# EAGLE design 1 (EAGLE 7.5.0)
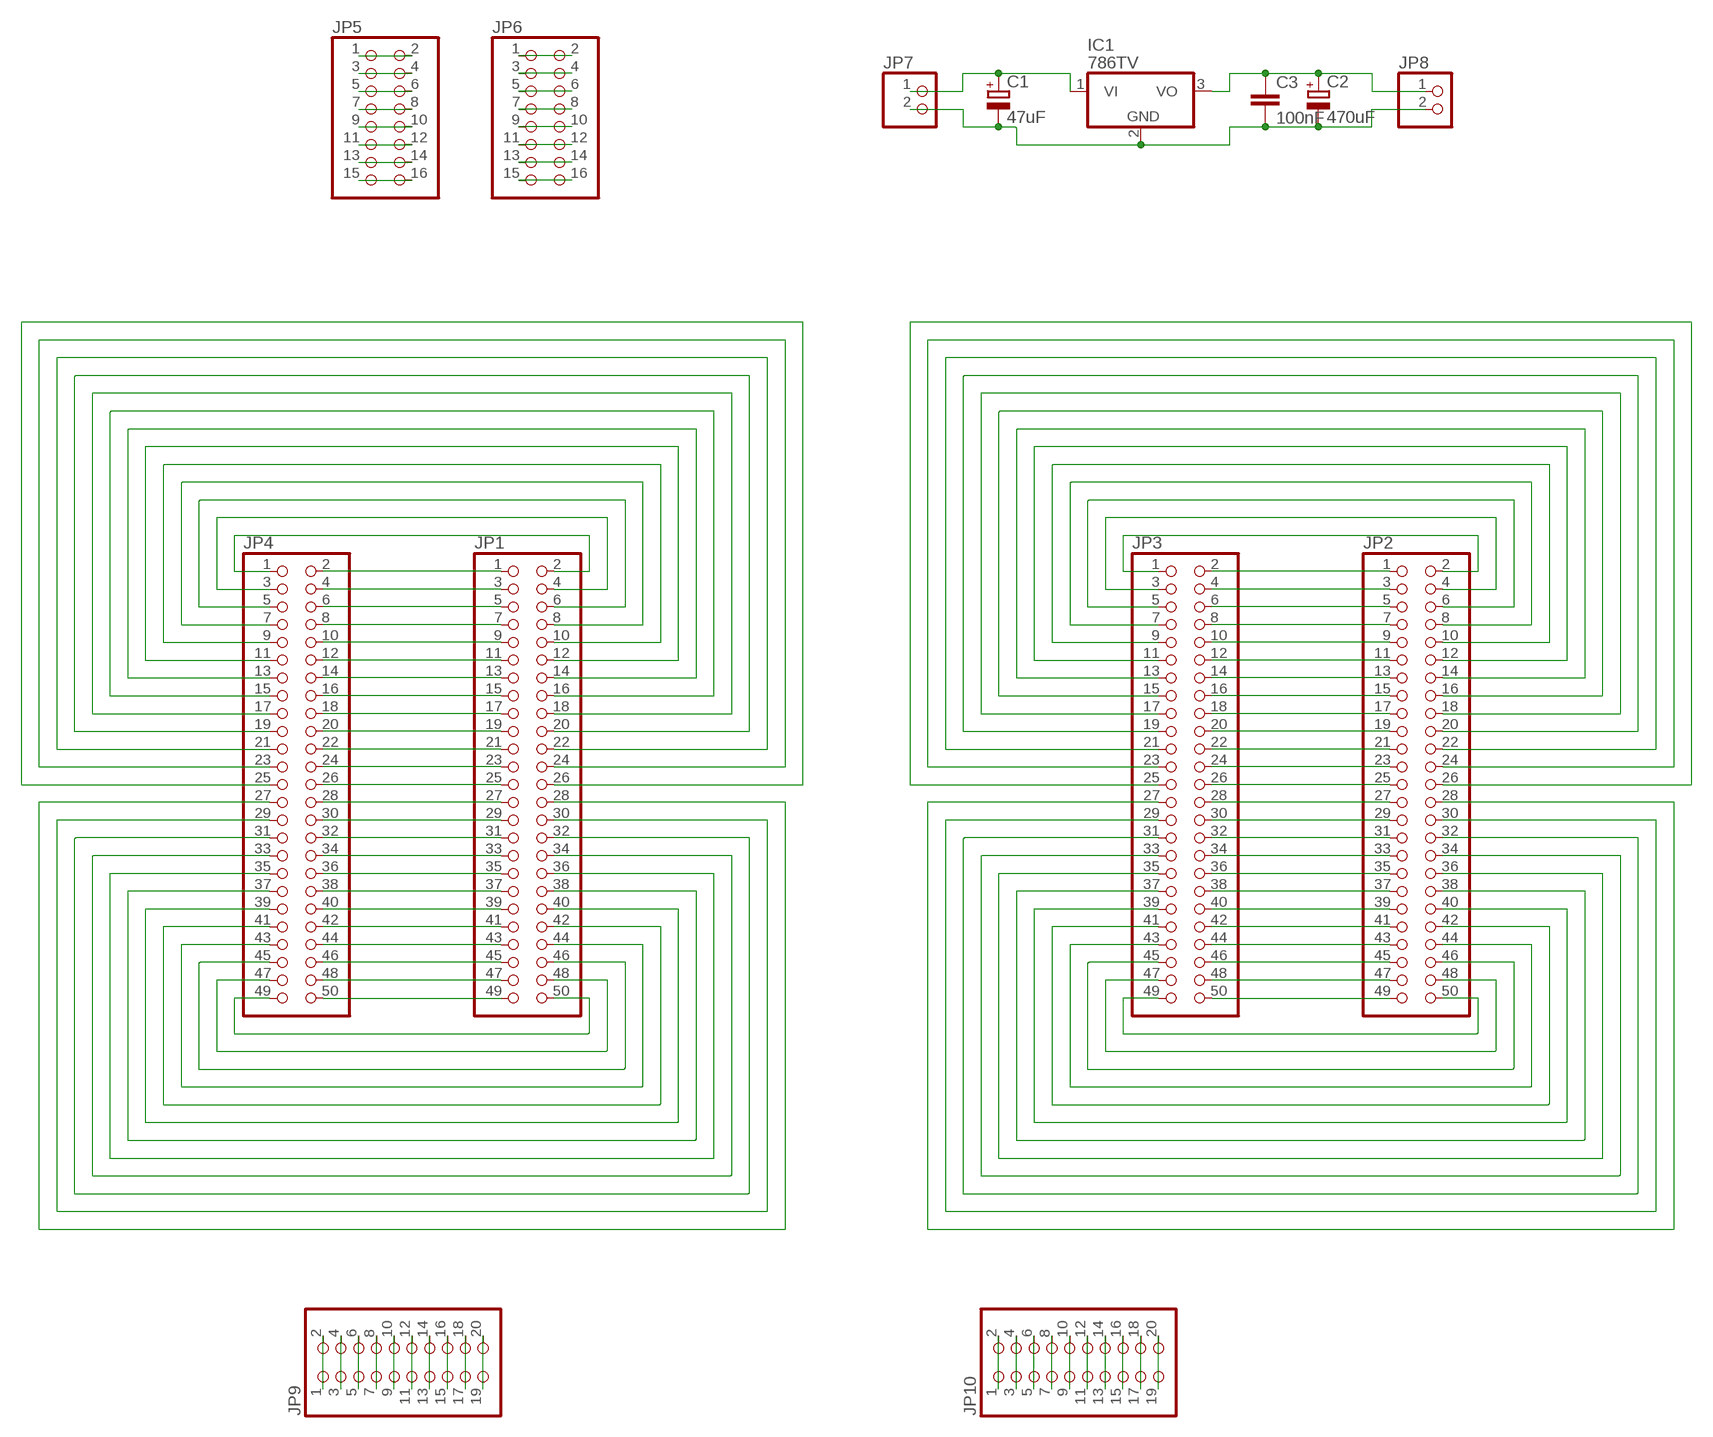
[diagram p0: schematic, sheet 1]

## Parts
C1  47uF  CPOL-EU153CLV-0405  [153CLV-0405]
C2  470uF  CPOL-EU153CLV-0405  [153CLV-0405]
C3  100nF  C-EU025-024X044  [C025-024X044]
IC1  786TV  [TO220V]
JP1  PINHD-2X25  [2X25]
JP2  PINHD-2X25  [2X25]
JP3  PINHD-2X25  [2X25]
JP4  PINHD-2X25  [2X25]
JP5  PINHD-2X8  [2X08]
JP6  PINHD-2X8  [2X08]
JP7  PINHD-1X2  [1X02]
JP8  PINHD-1X2  [1X02]
JP9  PINHD-2X10  [2X10]
JP10  PINHD-2X10  [2X10]

## Nets
N$1: JP5.1 JP5.2
N$2: JP5.3 JP5.4
N$3: JP5.5 JP5.6
N$4: JP5.7 JP5.8
N$5: JP5.9 JP5.10
N$6: JP5.11 JP5.12
N$7: JP5.13 JP5.14
N$8: JP5.15 JP5.16
N$9: JP6.1 JP6.2
N$10: JP6.3 JP6.4
N$11: JP6.5 JP6.6
N$12: JP6.7 JP6.8
N$13: JP6.9 JP6.10
N$14: JP6.11 JP6.12
N$15: JP6.13 JP6.14
N$16: JP6.15 JP6.16
N$17: C1.+ IC1.1(VI) JP7.1
N$18: C2.+ C3.1 IC1.3(VO) JP8.1
N$19: C1.- C2.- C3.2 IC1.2(GND) JP7.2 JP8.2
N$20: JP1.2 JP4.1
N$21: JP1.1 JP4.2
N$22: JP1.3 JP4.4
N$23: JP1.5 JP4.6
N$24: JP1.7 JP4.8
N$25: JP1.9 JP4.10
N$26: JP1.11 JP4.12
N$27: JP1.13 JP4.14
N$28: JP1.15 JP4.16
N$29: JP1.17 JP4.18
N$30: JP1.19 JP4.20
N$31: JP1.21 JP4.22
N$32: JP1.23 JP4.24
N$33: JP1.25 JP4.26
N$34: JP1.27 JP4.28
N$35: JP1.29 JP4.30
N$36: JP1.31 JP4.32
N$37: JP1.33 JP4.34
N$38: JP1.35 JP4.36
N$39: JP1.37 JP4.38
N$40: JP1.39 JP4.40
N$41: JP1.41 JP4.42
N$42: JP1.43 JP4.44
N$43: JP1.45 JP4.46
N$44: JP1.47 JP4.48
N$45: JP1.4 JP4.3
N$46: JP1.6 JP4.5
N$47: JP1.8 JP4.7
N$48: JP1.10 JP4.9
N$49: JP1.12 JP4.11
N$50: JP1.14 JP4.13
N$51: JP1.16 JP4.15
N$52: JP1.18 JP4.17
N$53: JP1.20 JP4.19
N$54: JP1.22 JP4.21
N$55: JP1.24 JP4.23
N$56: JP1.26 JP4.25
N$57: JP1.50 JP4.49
N$58: JP1.48 JP4.47
N$59: JP1.46 JP4.45
N$60: JP1.44 JP4.43
N$61: JP1.42 JP4.41
N$62: JP1.40 JP4.39
N$63: JP1.38 JP4.37
N$64: JP1.36 JP4.35
N$65: JP1.34 JP4.33
N$66: JP1.32 JP4.31
N$67: JP1.30 JP4.29
N$68: JP1.28 JP4.27
N$69: JP1.49 JP4.50
N$70: JP2.1 JP3.2
N$71: JP2.3 JP3.4
N$72: JP2.5 JP3.6
N$73: JP2.7 JP3.8
N$74: JP2.9 JP3.10
N$75: JP2.11 JP3.12
N$76: JP2.13 JP3.14
N$77: JP2.15 JP3.16
N$78: JP2.17 JP3.18
N$79: JP2.19 JP3.20
N$80: JP2.21 JP3.22
N$81: JP2.23 JP3.24
N$82: JP2.25 JP3.26
N$83: JP2.27 JP3.28
N$84: JP2.29 JP3.30
N$85: JP2.31 JP3.32
N$86: JP2.33 JP3.34
N$87: JP2.35 JP3.36
N$88: JP2.37 JP3.38
N$89: JP2.39 JP3.40
N$90: JP2.41 JP3.42
N$91: JP2.43 JP3.44
N$92: JP2.45 JP3.46
N$93: JP2.47 JP3.48
N$94: JP2.2 JP3.1
N$95: JP2.4 JP3.3
N$96: JP2.6 JP3.5
N$97: JP2.8 JP3.7
N$98: JP2.10 JP3.9
N$99: JP2.12 JP3.11
N$100: JP2.14 JP3.13
N$101: JP2.16 JP3.15
N$102: JP2.18 JP3.17
N$103: JP2.20 JP3.19
N$104: JP2.22 JP3.21
N$105: JP2.24 JP3.23
N$106: JP2.26 JP3.25
N$107: JP2.50 JP3.49
N$108: JP2.48 JP3.47
N$109: JP2.46 JP3.45
N$110: JP2.44 JP3.43
N$111: JP2.42 JP3.41
N$112: JP2.40 JP3.39
N$113: JP2.38 JP3.37
N$114: JP2.36 JP3.35
N$115: JP2.34 JP3.33
N$116: JP2.32 JP3.31
N$117: JP2.30 JP3.29
N$118: JP2.28 JP3.27
N$119: JP2.49 JP3.50
N$120: JP9.1 JP9.2
N$121: JP9.3 JP9.4
N$122: JP9.5 JP9.6
N$123: JP9.7 JP9.8
N$124: JP9.9 JP9.10
N$125: JP9.11 JP9.12
N$126: JP9.13 JP9.14
N$127: JP9.15 JP9.16
N$128: JP9.17 JP9.18
N$129: JP9.19 JP9.20
N$130: JP10.1 JP10.2
N$131: JP10.3 JP10.4
N$132: JP10.5 JP10.6
N$133: JP10.7 JP10.8
N$134: JP10.9 JP10.10
N$135: JP10.11 JP10.12
N$136: JP10.13 JP10.14
N$137: JP10.15 JP10.16
N$138: JP10.17 JP10.18
N$139: JP10.19 JP10.20

## Library data of the parts
C1 C2 = rcl:CPOL-EU: POLARIZED CAPACITOR, European symbol
C3 = rcl:C-EU: CAPACITOR, European symbol
IC1 = linear:78*: Positive VOLTAGE REGULATOR Source: http://cache.national.com/ds/LM/LM78L05.pdf http://www.fairchildsemi.com/ds/LM/LM7805.pdf
JP1-JP4 = pinhead:PINHD-2X25: PIN HEADER
JP5 JP6 = pinhead:PINHD-2X8: PIN HEADER
JP7 JP8 = pinhead:PINHD-1X2: PIN HEADER
JP9 JP10 = pinhead:PINHD-2X10: PIN HEADER

## Board
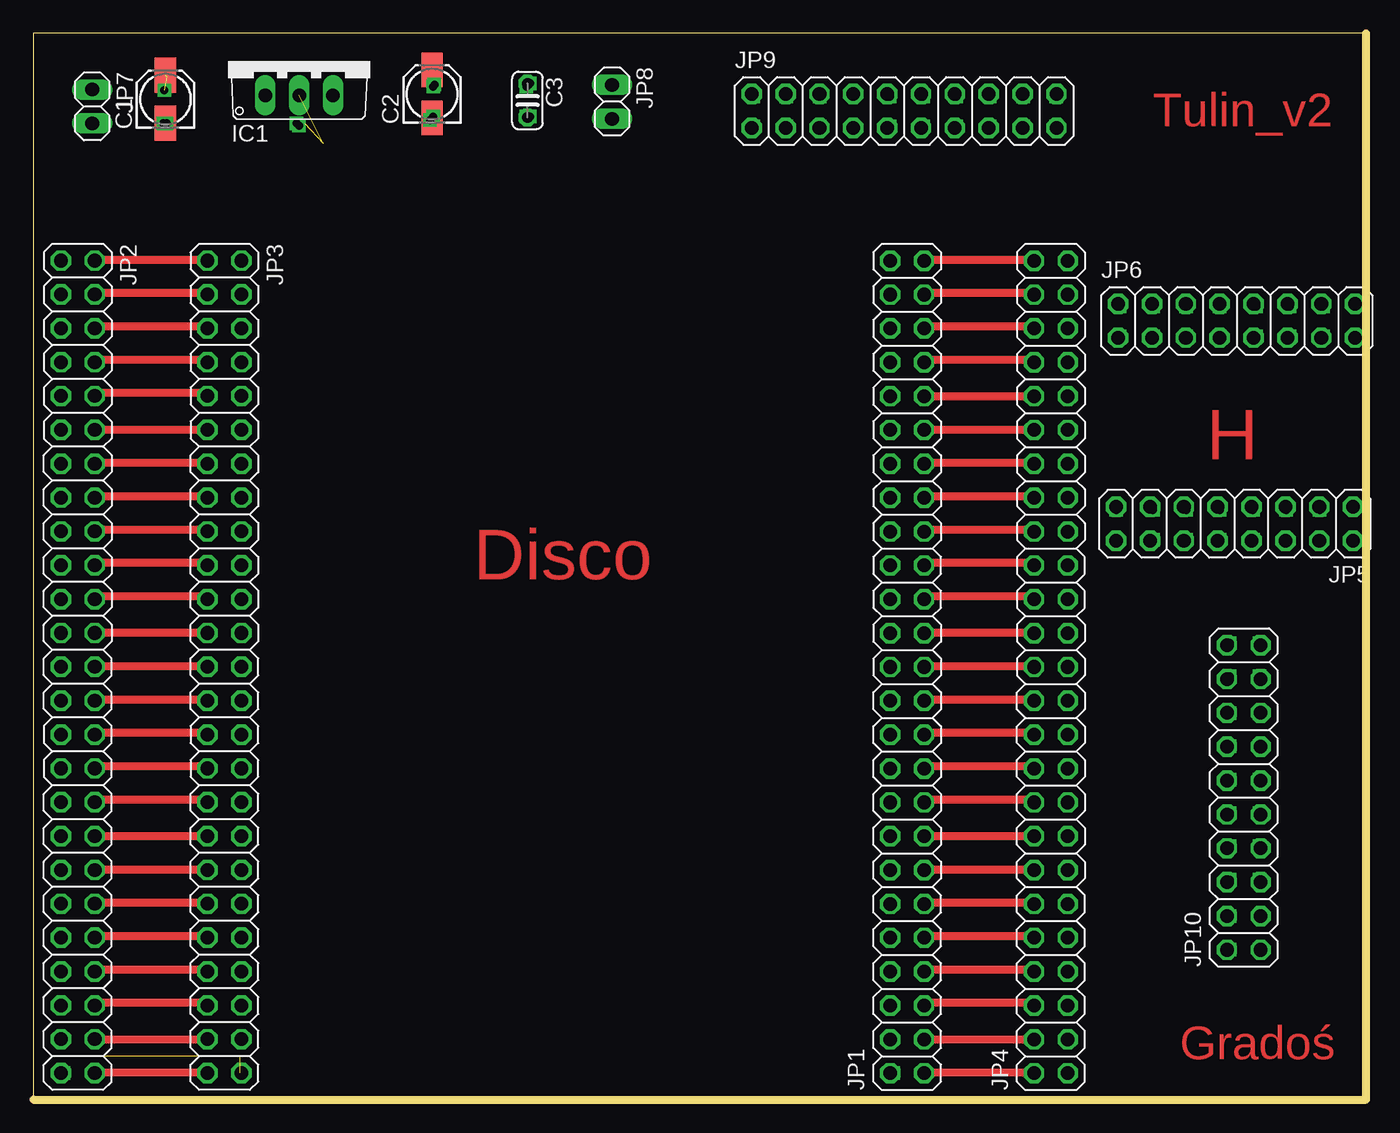
[diagram p1: board, top side]
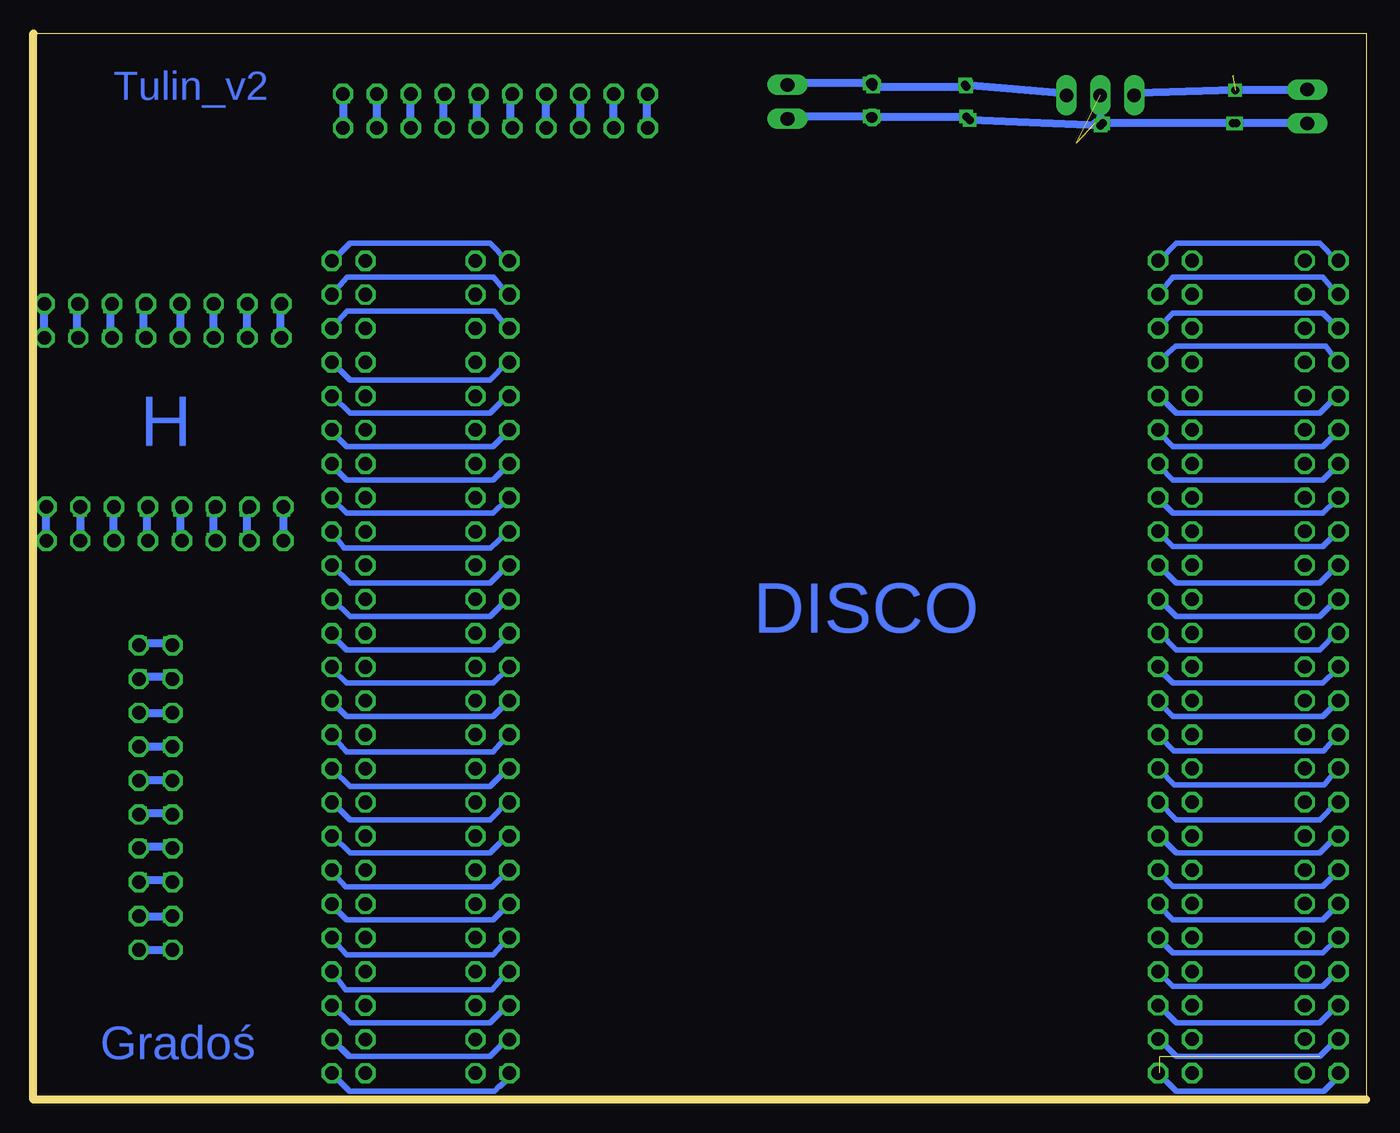
[diagram p2: board, bottom side, seen from below]

Size 100 x 80 mm. Coordinates in mm from the lower left corner, seen from the top.
Outline: 0,0 100,0 100,80 0,80 0,0
Copper layers (1*16): Top 0.035mm / dielectric 1.5mm / Bottom 0.035mm
Design rules "default": minimum track width 10mil, minimum drill 24mil, track to track 8mil, track to pad 8mil, pad to pad 8mil, via to via 8mil, smd to smd 8mil, copper to edge 40mil, drill to drill 8mil, minimum pad ring 10mil, minimum via ring 8mil, stop-mask expansion 4mil, vias tented up to drill 0mil, thermal gap 10mil

### Footprints (pad centres in the part's own frame; a part is rotated, then mirrored left to right if it is on the bottom)
153CLV-0405 = smd 2.6 x 1.6: + 1.8,0; - -1.8,0
C025-024X044 = drill 0.813 octagon: 1 -1.27,0; 2 1.27,0
TO220V = drill 1.016 long: 1 -2.54,-2.54; 2 0,-2.54; 3 2.54,-2.54
2X25 = drill 1.016 octagon: 1 -30.48,-1.27; 2 -30.48,1.27; 3 -27.94,-1.27; 4 -27.94,1.27; 5 -25.4,-1.27; 6 -25.4,1.27; 7 -22.86,-1.27; 8 -22.86,1.27; 9 -20.32,-1.27; 10 -20.32,1.27; 11 -17.78,-1.27; 12 -17.78,1.27; 13 -15.24,-1.27; 14 -15.24,1.27; 15 -12.7,-1.27; 16 -12.7,1.27; 17 -10.16,-1.27; 18 -10.16,1.27; 19 -7.62,-1.27; 20 -7.62,1.27; 21 -5.08,-1.27; 22 -5.08,1.27; 23 -2.54,-1.27; 24 -2.54,1.27; 25 0,-1.27; 26 0,1.27; 27 2.54,-1.27; 28 2.54,1.27; 29 5.08,-1.27; 30 5.08,1.27; 31 7.62,-1.27; 32 7.62,1.27; 33 10.16,-1.27; 34 10.16,1.27; 35 12.7,-1.27; 36 12.7,1.27; 37 15.24,-1.27; 38 15.24,1.27; 39 17.78,-1.27; 40 17.78,1.27; 41 20.32,-1.27; 42 20.32,1.27; 43 22.86,-1.27; 44 22.86,1.27; 45 25.4,-1.27; 46 25.4,1.27; 47 27.94,-1.27; 48 27.94,1.27; 49 30.48,-1.27; 50 30.48,1.27
2X08 = drill 1.016 octagon: 1 -8.89,-1.27; 2 -8.89,1.27; 3 -6.35,-1.27; 4 -6.35,1.27; 5 -3.81,-1.27; 6 -3.81,1.27; 7 -1.27,-1.27; 8 -1.27,1.27; 9 1.27,-1.27; 10 1.27,1.27; 11 3.81,-1.27; 12 3.81,1.27; 13 6.35,-1.27; 14 6.35,1.27; 15 8.89,-1.27; 16 8.89,1.27
1X02 = drill 1.016 long: 1 -1.27,0; 2 1.27,0
2X10 = drill 1.016 octagon: 1 -11.43,-1.27; 2 -11.43,1.27; 3 -8.89,-1.27; 4 -8.89,1.27; 5 -6.35,-1.27; 6 -6.35,1.27; 7 -3.81,-1.27; 8 -3.81,1.27; 9 -1.27,-1.27; 10 -1.27,1.27; 11 1.27,-1.27; 12 1.27,1.27; 13 3.81,-1.27; 14 3.81,1.27; 15 6.35,-1.27; 16 6.35,1.27; 17 8.89,-1.27; 18 8.89,1.27; 19 11.43,-1.27; 20 11.43,1.27

### Placement (x,y rotation side)
C1  9.92,75.06 90 top
C2  29.92,75.44 90 top
C3  37.07,74.96 270 top
IC1  19.95,77.89 0 top
JP1  65.56,32.45 90 top
JP2  3.33,32.47 270 top
JP3  14.34,32.47 270 top
JP4  76.34,32.45 90 top
JP5  90.13,43.2 180 top
JP6  90.28,58.44 0 top
JP7  4.42,74.51 270 top
JP8  43.42,74.86 270 top
JP9  65.33,74.18 0 top
JP10  90.82,22.66 90 top

### Tracks (layer width: path | path; a pad name or v marks a point on that pad's centre or on a via)
N$1
  Bottom 0.61: JP5.2 JP5.1
N$2  (via drill 0.6)
  Top 0.61: v96.5,42 JP5.4 | v96.5,44.25 JP5.3
  Bottom 0.61: v96.5,44.25 v96.5,42
N$3  (via drill 0.6)
  Top 0.61: v94,42 JP5.6 | v94,44.25 JP5.5
  Bottom 0.61: v94,44.25 v94,42
N$4  (via drill 0.6)
  Top 0.61: v91.5,42 JP5.8 | v91.5,44.25 JP5.7
  Bottom 0.61: v91.5,44.25 v91.5,42
N$5  (via drill 0.6)
  Top 0.61: v89,42 JP5.10 | v89,44.25 JP5.9
  Bottom 0.61: v89,44.25 v89,42
N$6  (via drill 0.6)
  Top 0.61: v86.5,42 JP5.12 | v86.5,44.25 JP5.11
  Bottom 0.61: v86.5,44.25 v86.5,42
N$7  (via drill 0.6)
  Top 0.61: v84,42 JP5.14 | v84,44.25 JP5.13
  Bottom 0.61: v84,44.25 v84,42
N$8  (via drill 0.6)
  Top 0.61: v81.25,42 JP5.16 | v81.25,44.25 JP5.15
  Bottom 0.61: v81.25,44.25 v81.25,42
N$9  (via drill 0.6)
  Top 0.61: v81.5,57.25 JP6.1 | v81.5,59.5 JP6.2
  Bottom 0.61: v81.5,59.5 v81.5,57.25
N$10  (via drill 0.6)
  Top 0.61: v84,57.25 JP6.3 | v84,59.5 JP6.4
  Bottom 0.61: v84,59.5 v84,57.25
N$11  (via drill 0.6)
  Top 0.61: v86.5,57.25 JP6.5 | v86.5,59.5 JP6.6
  Bottom 0.61: v86.5,59.5 v86.5,57.25
N$12  (via drill 0.6)
  Top 0.61: v89,57.25 JP6.7 | v89,59.5 JP6.8
  Bottom 0.61: v89,59.5 v89,57.25
N$13  (via drill 0.6)
  Top 0.61: v91.75,57.25 JP6.9 | v91.75,59.5 JP6.10
  Bottom 0.61: v91.75,59.5 v91.75,57.25
N$14  (via drill 0.6)
  Top 0.61: v94.25,57.25 JP6.11 | v94.25,59.5 JP6.12
  Bottom 0.61: v94.25,59.5 v94.25,57.25
N$15  (via drill 0.6)
  Top 0.61: v96.75,57.25 JP6.13 | v96.75,59.5 JP6.14
  Bottom 0.61: v96.75,59.5 v96.75,57.25
N$16
  Bottom 0.61: JP6.15 JP6.16
N$17  (via drill 0.6)  (2 unrouted)
  Top 0.61: v4.5,75.75 4.5,76 JP7.1 | v17.25,75.5 IC1.1
  Bottom 0.61: v4.5,75.75 9.75,75.75 9.92,75.86 | v9.83,75.73 v17.25,75.5
N$18  (via drill 0.6)
  Top 0.61: v37,76 37,76.25 C3.1 v37.25,76.25 | v30,76 C2.+ 29.75,77 v30.1,76.15 | v22.5,75.5 IC1.3 | v43.25,76.25 JP8.1
  Bottom 0.61: v37,76 v30,76 | v30.1,76.15 v22.5,75.5 | v37.25,76.25 v43.25,76.25
N$19  (via drill 0.6)  (3 unrouted)
  Top 0.61: v30,73.75 C2.- v29.75,73.5 | v37,73.75 C3.2 v37.25,73.75 | v43.25,73.75 JP8.2 | v9.75,73.25 C1.- v10,73.25 | v4.5,73.25 JP7.2 | v19.75,73.25 v19.94,73.08 | v20,75.25 IC1.2
  Bottom 0.61: v37,73.75 v30,73.75 | v37.25,73.75 v43.25,73.75 | v4.5,73.25 v9.75,73.25 | v10,73.25 20.37,73.25 | v19.94,73.08 v29.75,73.5 | v19.75,73.25 20,73.25 v19.94,73.08 | v20,75.25 v19.94,73.08
N$20  (via drill 0.6)
  Top 0.61: v64.5,2 JP1.2 | 77.5,2 JP4.1
  Bottom 0.406: v64.5,2 64.5,1.5 65,1 65.04,1 65.41,0.64 76.28,0.64 JP4.1
N$21
  Top 0.61: JP1.1 67,2 75,2 JP4.2
N$22
  Top 0.61: JP1.3 67,4.5 75,4.5 JP4.4
N$23
  Top 0.61: JP1.5 67,7.25 75,7.25 JP4.6
N$24
  Top 0.61: JP1.7 67,9.75 75,9.75 JP4.8
N$25
  Top 0.61: JP1.9 67,12.25 75,12.25 JP4.10
N$26
  Top 0.61: JP1.11 67,14.75 75,14.75 JP4.12
N$27
  Top 0.61: JP1.13 67,17.25 75,17.25 JP4.14
N$28
  Top 0.61: JP1.15 67,19.75 75,19.75 JP4.16
N$29
  Top 0.61: JP1.17 67,22.5 75,22.5 JP4.18
N$30
  Top 0.61: JP1.19 67,25 75,25 JP4.20
N$31
  Top 0.61: JP1.21 67,27.5 75,27.5 JP4.22
N$32
  Top 0.61: JP1.23 67,30 75,30 JP4.24
N$33
  Top 0.61: JP1.25 67,32.5 75,32.5 JP4.26
N$34
  Top 0.61: JP1.27 67,35 75,35 JP4.28
N$35
  Top 0.61: JP1.29 67,37.75 75,37.75 JP4.30
N$36
  Top 0.61: JP1.31 67,40.25 75,40.25 JP4.32
N$37
  Top 0.61: JP1.33 67,42.75 75,42.75 JP4.34
N$38
  Top 0.61: JP1.35 67,45.25 75,45.25 JP4.36
N$39
  Top 0.61: JP1.37 67,47.75 75,47.75 JP4.38
N$40
  Top 0.61: JP1.39 67,50.25 75,50.25 JP4.40
N$41
  Top 0.61: JP1.41 67,52.75 75,52.75 JP4.42
N$42
  Top 0.61: JP1.43 67,55.5 75,55.5 JP4.44
N$43
  Top 0.61: JP1.45 67,58 75,58 JP4.46
N$44
  Top 0.61: JP1.47 67,60.5 75,60.5 JP4.48
N$45
  Bottom 0.406: 76.25,3.25 77.5,4.5 JP4.3 76.35,3.25 65.75,3.25 64.5,4.5 JP1.4
N$46
  Bottom 0.406: JP1.6 64.5,7 65.75,5.75 76.25,5.75 77.5,7 JP4.5
N$47
  Bottom 0.406: JP1.8 64.5,9.5 65.58,8.25 76.58,8.25 77.5,9.5 JP4.7
N$48
  Bottom 0.406: JP1.10 64.5,12 65.5,10.87 76.5,10.87 77.5,12 JP4.9
N$49
  Bottom 0.406: JP1.12 64.5,14.5 65.5,13.5 76.5,13.5 77.5,14.5 JP4.11
N$50
  Bottom 0.406: JP1.14 65.58,15.96 76.58,15.96 77.5,17 JP4.13
N$51
  Bottom 0.406: JP1.16 64.5,19.75 65.75,18.5 76.25,18.5 77.5,19.75 JP4.15
N$52
  Bottom 0.406: JP1.18 64.5,22.25 65.75,21 76.25,21 77.5,22.25 JP4.17
N$53
  Bottom 0.406: JP1.20 64.5,24.75 65.75,23.5 76.25,23.5 77.5,24.75 JP4.19
N$54
  Bottom 0.406: JP1.22 64.5,27.25 65.5,26.09 76.5,26.09 77.5,27.25 JP4.21
N$55
  Bottom 0.406: JP1.24 64.5,29.75 65.5,28.75 76.5,28.75 77.5,29.75 JP4.23
N$56
  Bottom 0.406: JP1.26 64.5,32.25 65.5,31.25 76.5,31.25 77.5,32.25 JP4.25
N$57
  Bottom 0.406: JP1.50 64.5,63 65.75,64.25 76.25,64.25 77.5,63 JP4.49
N$58
  Bottom 0.406: JP1.48 64.5,60.5 65.46,61.69 76.46,61.69 77.5,60.5 JP4.47
N$59
  Bottom 0.406: JP1.46 64.5,58 65.45,59.15 76.45,59.15 77.5,58 JP4.45
N$60
  Bottom 0.406: JP1.44 64.5,55.25 65.75,54 76.25,54 77.5,55.25 JP4.43
N$61
  Bottom 0.406: JP1.42 64.5,52.75 65.75,51.5 76.25,51.5 77.5,52.75 JP4.41
N$62
  Bottom 0.406: JP1.40 64.5,50 65.5,49 76.5,49 77.5,50 JP4.39
N$63
  Bottom 0.406: JP1.38 64.5,47.5 65.5,46.5 76.5,46.5 77.5,47.5 JP4.37
N$64
  Bottom 0.406: JP1.36 64.5,45 65.5,44 76.5,44 77.5,45 JP4.35
N$65
  Bottom 0.406: JP4.33 76.7,41.4 65.7,41.4 64.5,42.5 JP1.34
N$66
  Bottom 0.406: JP1.32 64.5,40 65.75,38.75 76.25,38.75 77.5,40 JP4.31
N$67
  Bottom 0.406: JP1.30 64.5,37.5 65.75,36.25 76.25,36.25 77.5,37.5 JP4.29
N$68
  Bottom 0.406: JP1.28 64.5,34.75 65.5,33.75 76.5,33.75 77.5,34.75 JP4.27
N$69
  Top 0.61: JP1.49 67,63 75,63 JP4.50
N$70
  Bottom 0.406: JP2.1 2.25,63 3.5,64.25 14.25,64.25 15.5,63 JP3.2
N$71
  Bottom 0.406: JP2.3 2.25,60.5 3.25,61.7 14.5,61.7 15.5,60.5 JP3.4
N$72
  Bottom 0.406: JP2.5 2.25,58 3.25,59 14.5,59 15.5,58 JP3.6
N$73
  Bottom 0.406: JP2.7 2.25,55.5 3.05,56.54 14.3,56.54 15.5,55.5 JP3.8
N$74
  Bottom 0.406: JP2.9 2.25,52.75 3.5,51.5 14.25,51.5 15.5,52.75 JP3.10
N$75
  Bottom 0.406: JP2.11 2.25,50 3.25,49 14.5,49 15.5,50 JP3.12
N$76
  Bottom 0.406: JP2.13 2.25,47.5 3.25,46.5 14.5,46.5 15.5,47.5 JP3.14
N$77
  Bottom 0.406: JP2.15 2.25,45 3.25,44 14.5,44 15.5,45 JP3.16
N$78
  Bottom 0.406: JP2.17 2.25,42.5 3.25,41.5 14.5,41.5 15.5,42.5 JP3.18
N$79
  Bottom 0.406: JP2.19 2.25,40 3.5,38.75 14.25,38.75 15.5,40 JP3.20
N$80
  Bottom 0.406: JP2.21 2.25,37.5 3.5,36.25 14.25,36.25 15.5,37.5 JP3.22
N$81
  Bottom 0.406: JP2.23 2.25,35 3.5,33.75 14.25,33.75 15.5,35 JP3.24
N$82
  Bottom 0.406: JP2.25 2.25,32.25 3.25,31.25 14.5,31.25 15.5,32.25 JP3.26
N$83
  Bottom 0.406: JP2.27 2.25,29.75 3.25,28.75 14.5,28.75 15.5,29.75 JP3.28
N$84
  Bottom 0.406: JP2.29 2.25,27.25 3.2,26.15 14.45,26.15 15.5,27.25 JP3.30
N$85
  Bottom 0.406: JP2.31 2.25,24.75 3.15,23.6 14.4,23.6 15.5,24.75 JP3.32
N$86
  Bottom 0.406: JP2.33 2.25,22.25 3.5,21 14.25,21 15.5,22.25 JP3.34
N$87
  Bottom 0.406: JP2.35 2.25,19.75 3.5,18.5 14.25,18.5 15.5,19.75 JP3.36
N$88
  Bottom 0.406: JP2.37 2.25,17 3.25,16 14.5,16 15.5,17 JP3.38
N$89
  Bottom 0.406: JP2.39 3.25,13.5 14.5,13.5 15.5,14.5 JP3.40
N$90
  Bottom 0.406: JP2.41 2.25,12 3.25,11 14.5,11 15.5,12 JP3.42
N$91
  Bottom 0.406: JP3.44 14.5,8.5 3.25,8.5 2.25,9.5 JP2.43
N$92
  Bottom 0.406: JP2.45 2.25,7 3.5,5.75 14.25,5.75 15.5,7 JP3.46
N$93
  Bottom 0.406: JP2.47 2.25,4.5 3.5,3.25 14.25,3.25 15.5,4.5 JP3.48
N$94
  Top 0.61: JP2.2 4.75,63 13,63 JP3.1
N$95
  Top 0.61: JP2.4 4.75,60.5 13,60.5 JP3.3
N$96
  Top 0.61: JP2.6 4.75,58 13,58 JP3.5
N$97
  Top 0.61: JP2.8 4.75,55.5 13,55.5 JP3.7
N$98
  Top 0.61: JP2.10 4.75,53 13,53 JP3.9
N$99
  Top 0.61: JP2.12 4.75,50.25 13,50.25 JP3.11
N$100
  Top 0.61: JP2.14 4.75,47.75 13,47.75 JP3.13
N$101
  Top 0.61: JP2.16 4.75,45.25 13,45.25 JP3.15
N$102
  Top 0.61: JP2.18 4.75,42.75 13,42.75 JP3.17
N$103
  Top 0.61: JP2.20 4.75,40.25 13,40.25 JP3.19
N$104
  Top 0.61: JP2.22 4.75,37.75 13,37.75 JP3.21
N$105
  Top 0.61: JP2.24 4.75,35 13,35 JP3.23
N$106
  Top 0.61: JP2.26 4.75,32.5 13,32.5 JP3.25
N$107
  Top 0.61: JP2.50 4.75,2 13,2 JP3.49
N$108
  Top 0.61: JP2.48 4.75,4.5 13,4.5 JP3.47
N$109
  Top 0.61: JP2.46 4.75,7.25 13,7.25 JP3.45
N$110
  Top 0.61: JP2.44 4.75,9.75 13,9.75 JP3.43
N$111
  Top 0.61: JP2.42 4.75,12.25 13,12.25 JP3.41
N$112
  Top 0.61: JP2.40 4.75,14.75 13,14.75 JP3.39
N$113
  Top 0.61: JP2.38 4.75,17.25 13,17.25 JP3.37
N$114
  Top 0.61: JP2.36 4.75,19.75 13,19.75 JP3.35
N$115
  Top 0.61: JP2.34 4.75,22.5 13,22.5 JP3.33
N$116
  Top 0.61: JP2.32 4.75,25 13,25 JP3.31
N$117
  Top 0.61: JP2.30 4.75,27.5 13,27.5 JP3.29
N$118
  Top 0.61: JP2.28 4.75,30 13,30 JP3.27
N$119  (via drill 0.6)  (2 unrouted)
  Top 0.61: v2.25,2 JP2.49 | 15.5,2 JP3.50
  Bottom 0.406: v2.25,2 2,2 2,1.81 3.17,0.64 14.26,0.64 JP3.50
N$120  (via drill 0.6)
  Top 0.61: v54,73 JP9.1 | v54,75.25 JP9.2
  Bottom 0.61: v54,75.25 v54,73
N$121  (via drill 0.6)
  Top 0.61: v56.5,73 JP9.3 | v56.5,75.25 JP9.4
  Bottom 0.61: v56.5,75.25 v56.5,73
N$122  (via drill 0.6)
  Top 0.61: v59,73 JP9.5 | v59,75.25 JP9.6
  Bottom 0.61: v59,75.25 v59,73
N$123
  Bottom 0.61: JP9.7 JP9.8
N$124  (via drill 0.6)
  Top 0.61: v64.25,73 JP9.9 | v64.25,75.25 JP9.10
  Bottom 0.61: v64.25,75.25 v64.25,73
N$125  (via drill 0.6)
  Top 0.61: v66.75,73 JP9.11 | v66.75,75.25 JP9.12
  Bottom 0.61: v66.75,75.25 v66.75,73
N$126  (via drill 0.6)
  Top 0.61: v69.25,73 JP9.13 | v69.25,75.25 JP9.14
  Bottom 0.61: v69.25,75.25 v69.25,73
N$127  (via drill 0.6)
  Top 0.61: v71.75,73 JP9.15 | v71.75,75.25 JP9.16
  Bottom 0.61: v71.75,75.25 v71.75,73
N$128  (via drill 0.6)
  Top 0.61: v74.25,73 JP9.17 | v74.25,75.25 JP9.18
  Bottom 0.61: v74.25,75.25 v74.25,73
N$129  (via drill 0.6)
  Top 0.61: v76.75,73 JP9.19 | v76.75,75.25 JP9.20
  Bottom 0.61: v76.75,75.25 v76.75,73
N$130  (via drill 0.6)
  Top 0.61: v89.75,11.25 JP10.2 | v92,11.25 JP10.1
  Bottom 0.61: v92,11.25 v89.75,11.25
N$131  (via drill 0.6)
  Top 0.61: v89.75,13.75 JP10.4 | v92,13.75 JP10.3
  Bottom 0.61: v92,13.75 v89.75,13.75
N$132  (via drill 0.6)
  Top 0.61: v89.75,16.5 JP10.6 | v92,16.5 JP10.5
  Bottom 0.61: v92,16.5 v89.75,16.5
N$133  (via drill 0.6)
  Top 0.61: v89.75,19 JP10.8 | v92,19 JP10.7
  Bottom 0.61: v92,19 v89.75,19
N$134  (via drill 0.6)
  Top 0.61: v89.75,21.5 JP10.10 | v92,21.5 JP10.9
  Bottom 0.61: v92,21.5 v89.75,21.5
N$135  (via drill 0.6)
  Top 0.61: v89.75,24 JP10.12 | v92,24 JP10.11
  Bottom 0.61: v92,24 v89.75,24
N$136  (via drill 0.6)
  Top 0.61: v89.75,26.5 JP10.14 | v92,26.5 JP10.13
  Bottom 0.61: v92,26.5 v89.75,26.5
N$137  (via drill 0.6)
  Top 0.61: v89.75,29 JP10.16 | v92,29 JP10.15
  Bottom 0.61: v92,29 v89.75,29
N$138  (via drill 0.6)
  Top 0.61: v89.75,31.75 JP10.18 | v92,31.75 JP10.17
  Bottom 0.61: v92,31.75 v89.75,31.75
N$139  (via drill 0.6)
  Top 0.61: v89.75,34.25 JP10.20 | v92,34.25 JP10.19
  Bottom 0.61: v92,34.25 v89.75,34.25

### Text on the board
Top: Tulin_v2 | H | Disco | Gradoś
Bottom: Tulin_v2 | H | DISCO | Gradoś